# Altium project XilinxZynq7030SOM.PrjPcb (part 2 of 2)

## Sheet DDR3Modules.SchDoc
size A3; SheetNumber: 16; SheetTotal: 18
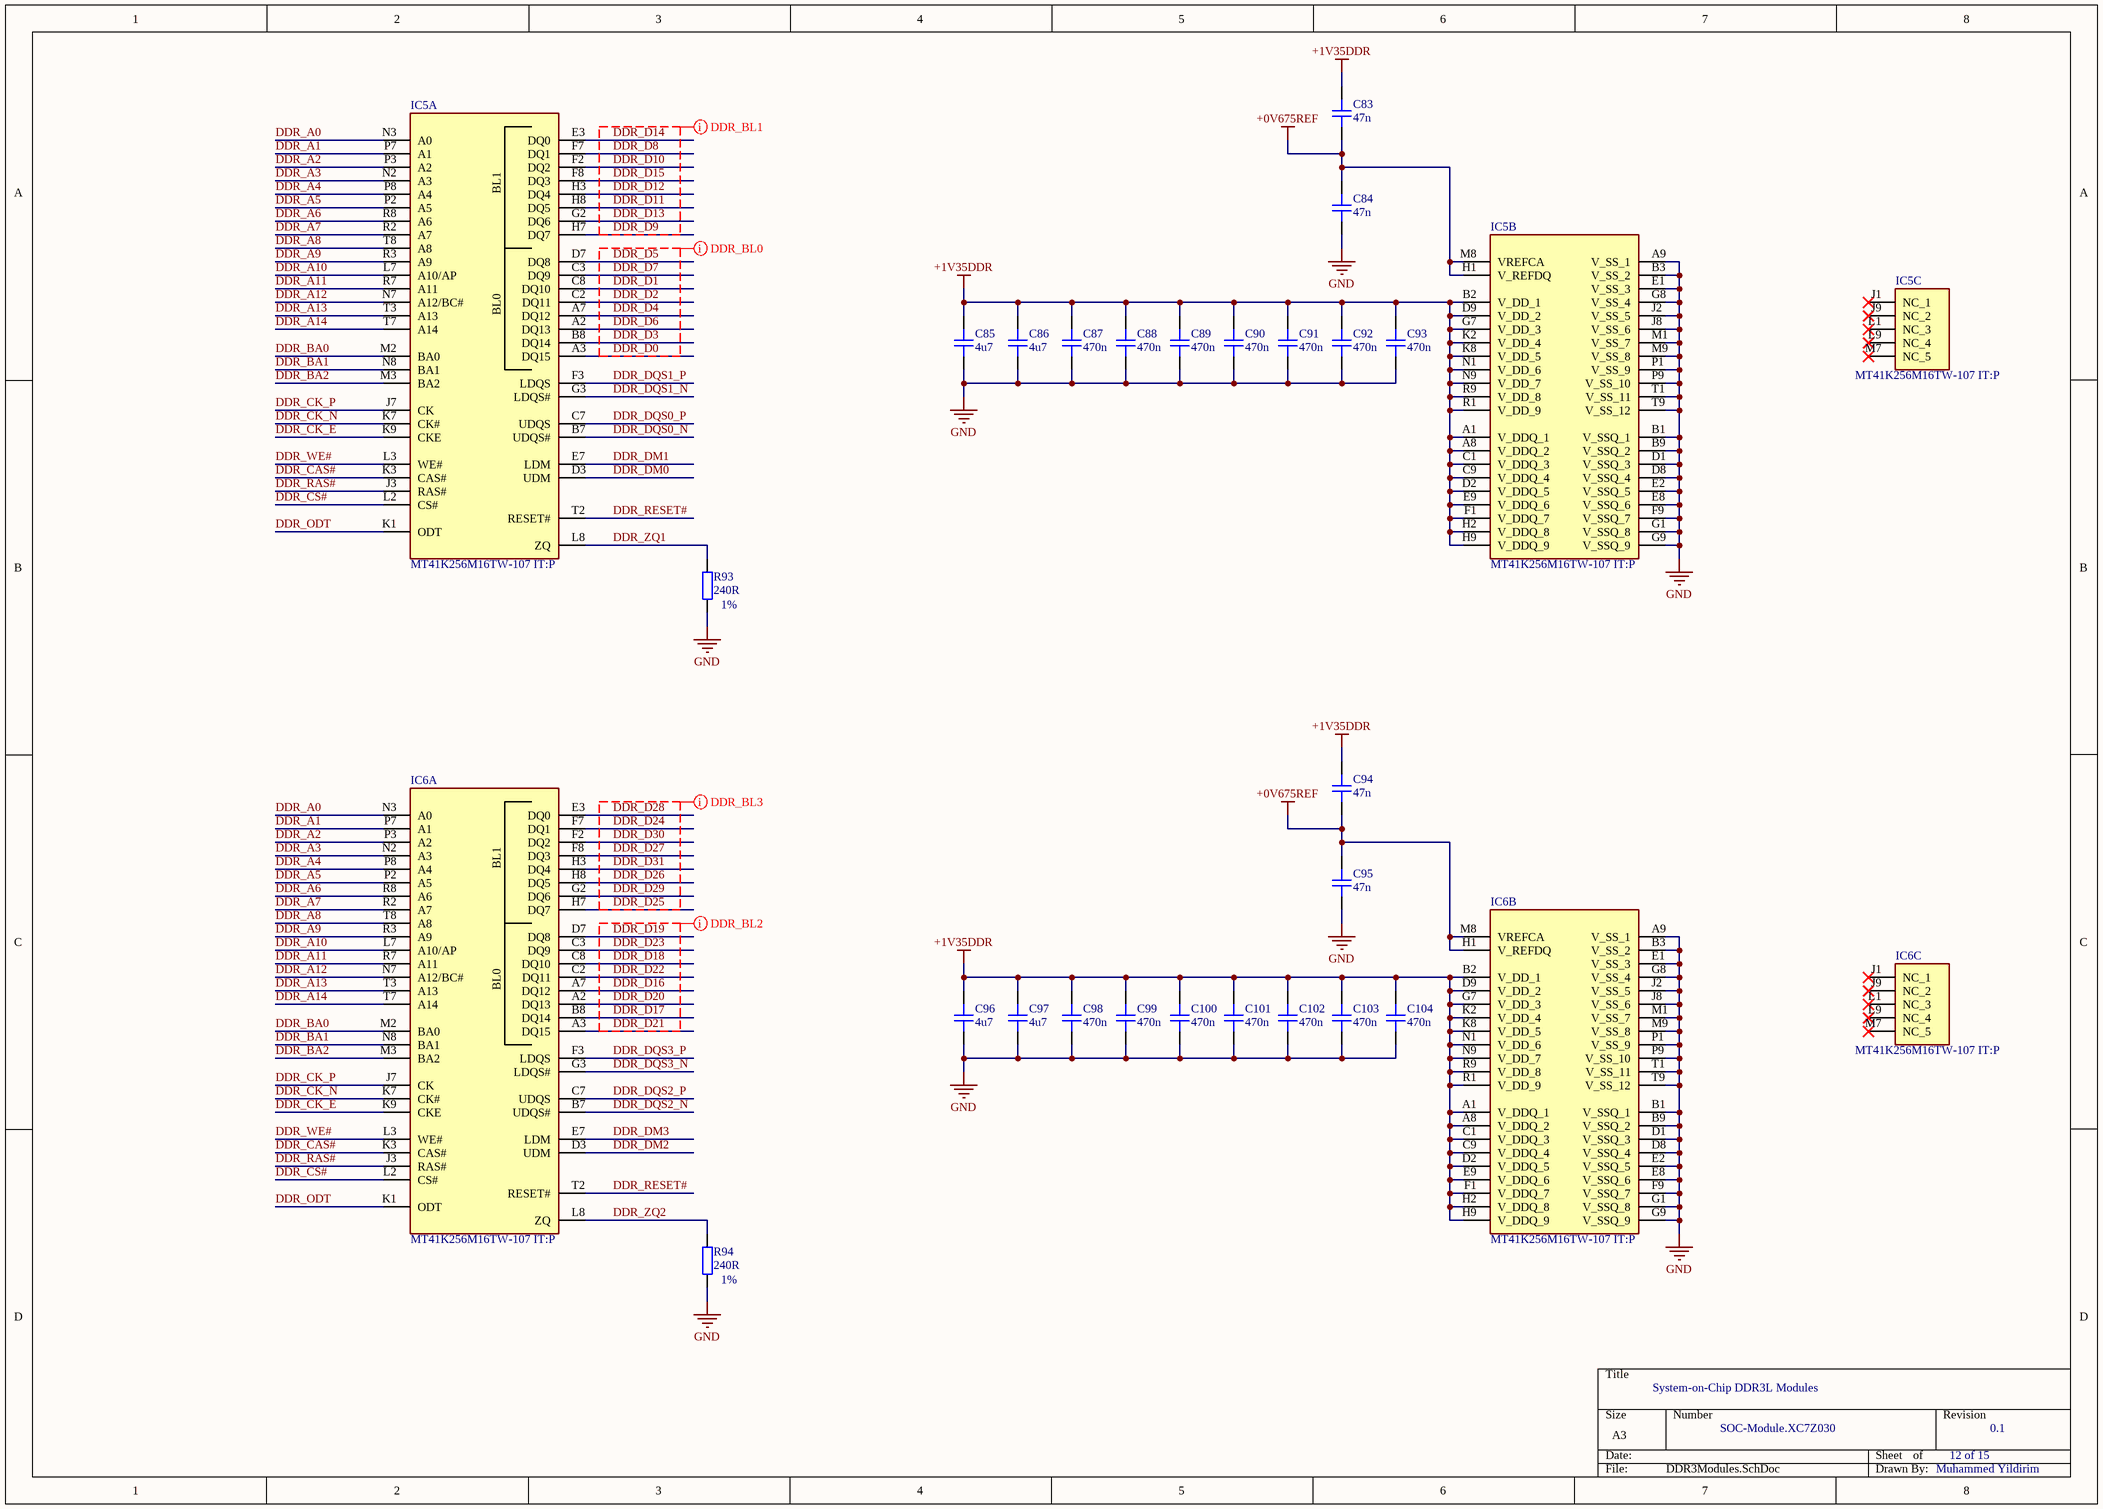
[diagram p15: DDR3Modules.SchDoc]

### Parts
C83  47n  [CAP_0201]
C84  47n  [CAP_0201]
C85  4u7  [CAP_0402]
C86  4u7  [CAP_0402]
C87  470n  [CAP_0201]
C88  470n  [CAP_0201]
C89  470n  [CAP_0201]
C90  470n  [CAP_0201]
C91  470n  [CAP_0201]
C92  470n  [CAP_0201]
C93  470n  [CAP_0201]
C94  47n  [CAP_0201]
C95  47n  [CAP_0201]
C96  4u7  [CAP_0402]
C97  4u7  [CAP_0402]
C98  470n  [CAP_0201]
C99  470n  [CAP_0201]
C100  470n  [CAP_0201]
C101  470n  [CAP_0201]
C102  470n  [CAP_0201]
C103  470n  [CAP_0201]
C104  470n  [CAP_0201]
IC5  MT41K256M16TW-107 IT:P  [BGA96C80P9X16_800X1400X120]  (parts A,B,C of 3)
IC6  MT41K256M16TW-107 IT:P  [BGA96C80P9X16_800X1400X120]  (parts A,B,C of 3)
R93  240R  [RES_0201]
R94  240R  [RES_0201]

### Nets
+0V675REF: C83.1 C84.2 C94.1 C95.2 IC5.H1(V_REFDQ) IC5.M8(VREFCA) IC6.H1(V_REFDQ) IC6.M8(VREFCA)
+1V35DDR: C83.2 C85.2 C86.2 C87.2 C88.2 C89.2 C90.2 C91.2 C92.2 C93.2 C94.2 C96.2 C97.2 C98.2 C99.2 C100.2 C101.2 C102.2 C103.2 C104.2 IC5.A1(V_DDQ_1) IC5.A8(V_DDQ_2) IC5.B2(V_DD_1) IC5.C1(V_DDQ_3) IC5.C9(V_DDQ_4) IC5.D2(V_DDQ_5) IC5.D9(V_DD_2) IC5.E9(V_DDQ_6) IC5.F1(V_DDQ_7) IC5.G7(V_DD_3) IC5.H2(V_DDQ_8) IC5.H9(V_DDQ_9) IC5.K2(V_DD_4) IC5.K8(V_DD_5) IC5.N1(V_DD_6) IC5.N9(V_DD_7) IC5.R1(V_DD_9) IC5.R9(V_DD_8) IC6.A1(V_DDQ_1) IC6.A8(V_DDQ_2) IC6.B2(V_DD_1) IC6.C1(V_DDQ_3) IC6.C9(V_DDQ_4) IC6.D2(V_DDQ_5) IC6.D9(V_DD_2) IC6.E9(V_DDQ_6) IC6.F1(V_DDQ_7) IC6.G7(V_DD_3) IC6.H2(V_DDQ_8) IC6.H9(V_DDQ_9) IC6.K2(V_DD_4) IC6.K8(V_DD_5) IC6.N1(V_DD_6) IC6.N9(V_DD_7) IC6.R1(V_DD_9) IC6.R9(V_DD_8)
GND: C84.1 C85.1 C86.1 C87.1 C88.1 C89.1 C90.1 C91.1 C92.1 C93.1 C95.1 C96.1 C97.1 C98.1 C99.1 C100.1 C101.1 C102.1 C103.1 C104.1 IC5.A9(V_SS_1) IC5.B1(V_SSQ_1) IC5.B3(V_SS_2) IC5.B9(V_SSQ_2) IC5.D1(V_SSQ_3) IC5.D8(V_SSQ_4) IC5.E1(V_SS_3) IC5.E2(V_SSQ_5) IC5.E8(V_SSQ_6) IC5.F9(V_SSQ_7) IC5.G1(V_SSQ_8) IC5.G8(V_SS_4) IC5.G9(V_SSQ_9) IC5.J2(V_SS_5) IC5.J8(V_SS_6) IC5.M1(V_SS_7) IC5.M9(V_SS_8) IC5.P1(V_SS_9) IC5.P9(V_SS_10) IC5.T1(V_SS_11) IC5.T9(V_SS_12) IC6.A9(V_SS_1) IC6.B1(V_SSQ_1) IC6.B3(V_SS_2) IC6.B9(V_SSQ_2) IC6.D1(V_SSQ_3) IC6.D8(V_SSQ_4) IC6.E1(V_SS_3) IC6.E2(V_SSQ_5) IC6.E8(V_SSQ_6) IC6.F9(V_SSQ_7) IC6.G1(V_SSQ_8) IC6.G8(V_SS_4) IC6.G9(V_SSQ_9) IC6.J2(V_SS_5) IC6.J8(V_SS_6) IC6.M1(V_SS_7) IC6.M9(V_SS_8) IC6.P1(V_SS_9) IC6.P9(V_SS_10) IC6.T1(V_SS_11) IC6.T9(V_SS_12) R93.1 R94.1
DDR_A0: IC5.N3(A0) IC6.N3(A0)
DDR_A1: IC5.P7(A1) IC6.P7(A1)
DDR_A2: IC5.P3(A2) IC6.P3(A2)
DDR_A3: IC5.N2(A3) IC6.N2(A3)
DDR_A4: IC5.P8(A4) IC6.P8(A4)
DDR_A5: IC5.P2(A5) IC6.P2(A5)
DDR_A6: IC5.R8(A6) IC6.R8(A6)
DDR_A7: IC5.R2(A7) IC6.R2(A7)
DDR_A8: IC5.T8(A8) IC6.T8(A8)
DDR_A9: IC5.R3(A9) IC6.R3(A9)
DDR_A10: IC5.L7(A10/AP) IC6.L7(A10/AP)
DDR_A11: IC5.R7(A11) IC6.R7(A11)
DDR_A12: IC5.N7(A12/BC#) IC6.N7(A12/BC#)
DDR_A13: IC5.T3(A13) IC6.T3(A13)
DDR_A14: IC5.T7(A14) IC6.T7(A14)
DDR_BA0: IC5.M2(BA0) IC6.M2(BA0)
DDR_BA1: IC5.N8(BA1) IC6.N8(BA1)
DDR_BA2: IC5.M3(BA2) IC6.M3(BA2)
DDR_CAS#: IC5.K3(CAS#) IC6.K3(CAS#)
DDR_CK_E: IC5.K9(CKE) IC6.K9(CKE)
DDR_CK_N: IC5.K7(CK#) IC6.K7(CK#)
DDR_CK_P: IC5.J7(CK) IC6.J7(CK)
DDR_CS#: IC5.L2(CS#) IC6.L2(CS#)
DDR_D0: IC5.A3(DQ15)
DDR_D1: IC5.C8(DQ10)
DDR_D2: IC5.C2(DQ11)
DDR_D3: IC5.B8(DQ14)
DDR_D4: IC5.A7(DQ12)
DDR_D5: IC5.D7(DQ8)
DDR_D6: IC5.A2(DQ13)
DDR_D7: IC5.C3(DQ9)
DDR_D8: IC5.F7(DQ1)
DDR_D9: IC5.H7(DQ7)
DDR_D10: IC5.F2(DQ2)
DDR_D11: IC5.H8(DQ5)
DDR_D12: IC5.H3(DQ4)
DDR_D13: IC5.G2(DQ6)
DDR_D14: IC5.E3(DQ0)
DDR_D15: IC5.F8(DQ3)
DDR_D16: IC6.A7(DQ12)
DDR_D17: IC6.B8(DQ14)
DDR_D18: IC6.C8(DQ10)
DDR_D19: IC6.D7(DQ8)
DDR_D20: IC6.A2(DQ13)
DDR_D21: IC6.A3(DQ15)
DDR_D22: IC6.C2(DQ11)
DDR_D23: IC6.C3(DQ9)
DDR_D24: IC6.F7(DQ1)
DDR_D25: IC6.H7(DQ7)
DDR_D26: IC6.H8(DQ5)
DDR_D27: IC6.F8(DQ3)
DDR_D28: IC6.E3(DQ0)
DDR_D29: IC6.G2(DQ6)
DDR_D30: IC6.F2(DQ2)
DDR_D31: IC6.H3(DQ4)
DDR_DM0: IC5.D3(UDM)
DDR_DM1: IC5.E7(LDM)
DDR_DM2: IC6.D3(UDM)
DDR_DM3: IC6.E7(LDM)
DDR_DQS0_N: IC5.B7(UDQS#)
DDR_DQS0_P: IC5.C7(UDQS)
DDR_DQS1_N: IC5.G3(LDQS#)
DDR_DQS1_P: IC5.F3(LDQS)
DDR_DQS2_N: IC6.B7(UDQS#)
DDR_DQS2_P: IC6.C7(UDQS)
DDR_DQS3_N: IC6.G3(LDQS#)
DDR_DQS3_P: IC6.F3(LDQS)
DDR_ODT: IC5.K1(ODT) IC6.K1(ODT)
DDR_RAS#: IC5.J3(RAS#) IC6.J3(RAS#)
DDR_RESET#: IC5.T2(RESET#) IC6.T2(RESET#)
DDR_WE#: IC5.L3(WE#) IC6.L3(WE#)
DDR_ZQ1: IC5.L8(ZQ) R93.2
DDR_ZQ2: IC6.L8(ZQ) R94.2

Not connected (* = marked no-connect by the designer): IC5 J1(NC_1)* J9(NC_2)* L1(NC_3)* L9(NC_4)* M7(NC_5)*; IC6 J1(NC_1)* J9(NC_2)* L1(NC_3)* L9(NC_4)* M7(NC_5)*

### Layout directives
mark named DDR_BL1: DDR_D8, DDR_D9, DDR_D10, DDR_D11, DDR_D12, DDR_D13, DDR_D14, DDR_D15
mark named DDR_BL0: DDR_D0, DDR_D1, DDR_D2, DDR_D3, DDR_D4, DDR_D5, DDR_D6, DDR_D7
mark named DDR_BL2: DDR_D16, DDR_D17, DDR_D18, DDR_D19, DDR_D20, DDR_D21, DDR_D22, DDR_D23
mark named DDR_BL3: DDR_D24, DDR_D25, DDR_D26, DDR_D27, DDR_D28, DDR_D29, DDR_D30, DDR_D31

### Notes on the sheet
- (near R93) 1%
- (near R94) 1%
- System-on-Chip DDR3L Modules
- SOC-Module.XC7Z030
- 12 of 15
- 0.1
- Muhammed Yildirim
- (in symbol MT41K256M16TW-107 IT:P, part A) BL1; BL0

### Library data of the parts
C83 C84 C87-C95 C98-C104 = CAP_0201: Capacitor SMD 0201; Manufacturer: *; Manufacturer Part Number: *; Distributor Link: *; LCSC: *; Rating: *; Dielectric: *
C85 C86 C96 C97 = CAP_0402: Capacitor SMD 0402; Manufacturer: *; Manufacturer Part Number: *; Distributor Link: *; LCSC: *; Rating: *; Dielectric: *
IC5 IC6 = MT41K256M16TW-107 IT:P: Integrated Circuit; Manufacturer_Name: Micron; Datasheet Link: https://datasheet.octopart.com/MT41K256M16TW-107-IT%3AP-Micron-datasheet-134530703.pdf; Height: 1.2mm; Manufacturer_Part_Number: MT41K256M16TW-107 IT:P; Mouser Part Number: 340-265862-TRAY; Mouser Price/Stock: https://www.mouser.co.uk/ProductDetail/Micron/MT41K256M16TW-107-ITP?qs=rrS6PyfT74dVaU4J%2FCiQdg%3D%3D; Arrow Part Number: MT41K256M16TW-107 IT:P; Arrow Price/Stock: https://www.arrow.com/en/products/mt41k256m16tw-107-itp/micron-technology?region=europe
R93 R94 = RES_0201: Resistor SMD 0201; Manufacturer: *; Manufacturer Part Number: *; Distributor Link: *; LCSC: *

## Sheet SOCEthernetPHY.SchDoc
size A4; SheetNumber: 17; SheetTotal: 18
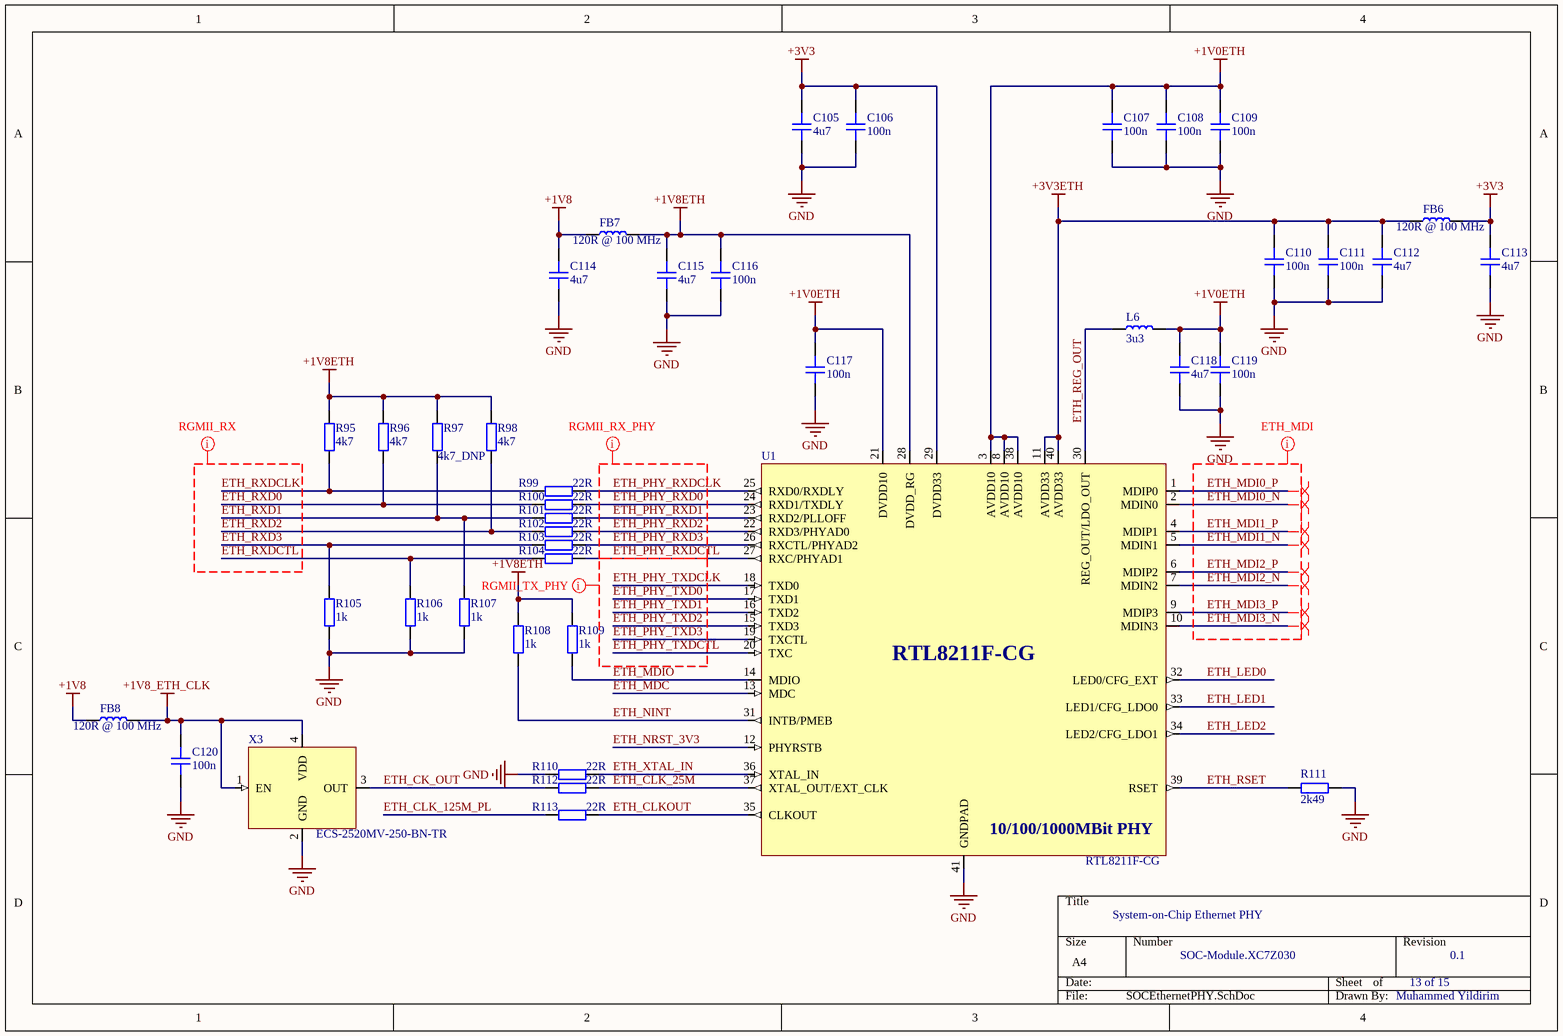
[diagram p16: SOCEthernetPHY.SchDoc]

### Parts
C105  4u7  [CAP_0402]
C106  100n  [CAP_0201]
C107  100n  [CAP_0201]
C108  100n  [CAP_0201]
C109  100n  [CAP_0201]
C110  100n  [CAP_0201]
C111  100n  [CAP_0201]
C112  4u7  [CAP_0402]
C113  4u7  [CAP_0402]
C114  4u7  [CAP_0402]
C115  4u7  [CAP_0402]
C116  100n  [CAP_0201]
C117  100n  [CAP_0201]
C118  4u7  [CAP_0402]
C119  100n  [CAP_0201]
C120  100n  [CAP_0201]
FB6  120R @ 100 MHz  [IND_0201]
FB7  120R @ 100 MHz  [IND_0201]
FB8  120R @ 100 MHz  [IND_0201]
L6  3u3  [IND_0402]
R95  4k7  [RES_0201]
R96  4k7  [RES_0201]
R97  4k7_DNP  [RES_0201]
R98  4k7  [RES_0201]
R99  22R  [RES_0201]
R100  22R  [RES_0201]
R101  22R  [RES_0201]
R102  22R  [RES_0201]
R103  22R  [RES_0201]
R104  22R  [RES_0201]
R105  1k  [RES_0201]
R106  1k  [RES_0201]
R107  1k  [RES_0201]
R108  1k  [RES_0201]
R109  1k  [RES_0201]
R110  22R  [RES_0201]
R111  2k49  [RES_0201]
R112  22R  [RES_0201]
R113  22R  [RES_0201]
U1  RTL8211F-CG  [QFN-40-0.4-EP]
X3  ECS-2520MV-250-BN-TR  [XTAL_2520]

### Nets
+1V0ETH: C107.2 C108.2 C109.2 C117.2 C118.2 C119.1 L6.2 U1.3(AVDD10) U1.8(AVDD10) U1.21(DVDD10) U1.38(AVDD10)
+1V8: C114.2 FB7.1 FB8.1
+1V8_ETH_CLK: C120.1 FB8.2 X3.1(EN) X3.4(VDD)
+1V8ETH: C115.2 C116.2 FB7.2 R95.1 R96.1 R97.1 R98.1 R108.1 R109.1 U1.28(DVDD_RG)
+3V3: C105.2 C106.2 C113.2 FB6.2 U1.29(DVDD33)
+3V3ETH: C110.1 C111.1 C112.2 FB6.1 U1.11(AVDD33) U1.40(AVDD33)
GND: C105.1 C106.1 C107.1 C108.1 C109.1 C110.2 C111.2 C112.1 C113.1 C114.1 C115.1 C116.1 C117.1 C118.1 C119.2 C120.2 R105.2 R106.2 R107.2 R110.1 R111.1 U1.41(GNDPAD) X3.2(GND)
ETH_CK_OUT: R112.1 X3.3(OUT)
ETH_CLK_25M: R112.2 U1.37(XTAL_OUT/EXT_CLK)
ETH_CLK_125M_PL: R113.1
ETH_CLKOUT: R113.2 U1.35(CLKOUT)
ETH_LED0: U1.32(LED0/CFG_EXT)
ETH_LED1: U1.33(LED1/CFG_LDO0)
ETH_LED2: U1.34(LED2/CFG_LDO1)
ETH_MDC: U1.13(MDC)
ETH_MDI0_N: U1.2(MDIN0)
ETH_MDI0_P: U1.1(MDIP0)
ETH_MDI1_N: U1.5(MDIN1)
ETH_MDI1_P: U1.4(MDIP1)
ETH_MDI2_N: U1.7(MDIN2)
ETH_MDI2_P: U1.6(MDIP2)
ETH_MDI3_N: U1.10(MDIN3)
ETH_MDI3_P: U1.9(MDIP3)
ETH_MDIO: R109.2 U1.14(MDIO)
ETH_NINT: R108.2 U1.31(INTB/PMEB)
ETH_NRST_3V3: U1.12(PHYRSTB)
ETH_PHY_RXD0: R100.1 U1.24(RXD1/TXDLY)
ETH_PHY_RXD1: R101.1 U1.23(RXD2/PLLOFF)
ETH_PHY_RXD2: R102.1 U1.22(RXD3/PHYAD0)
ETH_PHY_RXD3: R103.1 U1.26(RXCTL/PHYAD2)
ETH_PHY_RXDCLK: R99.1 U1.25(RXD0/RXDLY)
ETH_PHY_RXDCTL: R104.1 U1.27(RXC/PHYAD1)
ETH_PHY_TXD0: U1.17(TXD1)
ETH_PHY_TXD1: U1.16(TXD2)
ETH_PHY_TXD2: U1.15(TXD3)
ETH_PHY_TXD3: U1.19(TXCTL)
ETH_PHY_TXDCLK: U1.18(TXD0)
ETH_PHY_TXDCTL: U1.20(TXC)
ETH_REG_OUT: L6.1 U1.30(REG_OUT/LDO_OUT)
ETH_RSET: R111.2 U1.39(RSET)
ETH_RXD0: R96.2 R100.2
ETH_RXD1: R97.2 R101.2 R107.1
ETH_RXD2: R98.2 R102.2
ETH_RXD3: R103.2 R105.1
ETH_RXDCLK: R95.2 R99.2
ETH_RXDCTL: R104.2 R106.1
ETH_XTAL_IN: R110.2 U1.36(XTAL_IN)

### Layout directives
differential pair: ETH_MDI0_N, ETH_MDI0_P, ETH_MDI1_N, ETH_MDI1_P, ETH_MDI2_N, ETH_MDI2_P, ETH_MDI3_N, ETH_MDI3_P
mark named ETH_MDI: ETH_MDI0_N, ETH_MDI0_P, ETH_MDI1_N, ETH_MDI1_P, ETH_MDI2_N, ETH_MDI2_P, ETH_MDI3_N, ETH_MDI3_P
mark named RGMII_RX_PHY: ETH_PHY_RXD0, ETH_PHY_RXD1, ETH_PHY_RXD2, ETH_PHY_RXD3, ETH_PHY_RXDCLK, ETH_PHY_RXDCTL
mark named RGMII_RX: ETH_RXD0, ETH_RXD1, ETH_RXD2, ETH_RXD3, ETH_RXDCLK, ETH_RXDCTL
mark named RGMII_TX_PHY: ETH_PHY_RXDCTL, ETH_PHY_TXD0, ETH_PHY_TXD1, ETH_PHY_TXD2, ETH_PHY_TXD3, ETH_PHY_TXDCLK, ETH_PHY_TXDCTL

### Notes on the sheet
- System-on-Chip Ethernet PHY
- SOC-Module.XC7Z030
- 13 of 15
- 0.1
- Muhammed Yildirim
- (in symbol RTL8211F-CG) 10/100/1000MBit PHY

### Library data of the parts
C105 C112-C115 C118 = CAP_0402: Capacitor SMD 0402; Manufacturer: *; Manufacturer Part Number: *; Distributor Link: *; LCSC: *; Rating: *; Dielectric: *
C106-C111 C116 C117 C119 C120 = CAP_0201: Capacitor SMD 0201; Manufacturer: *; Manufacturer Part Number: *; Distributor Link: *; LCSC: *; Rating: *; Dielectric: *
FB6-FB8 = IND_0201: Inductor SMD 0201; Manufacturer_Name: Murata Electronics; Manufacturer_Part_Number: LQP03HQ56NH02D; Datasheet Link: https://psearch.en.murata.com/inductor/product/LQP03HQ56NH02%23.html; Height: 0.42mm; Mouser Part Number: 81-LQP03HQ56NH02D; Mouser Price/Stock: https://www.mouser.co.uk/ProductDetail/Murata-Electronics/LQP03HQ56NH02D?qs=B6kkDfuK7%2FBQu1Ob9%2FT2Bg%3D%3D
L6 = IND_0402: Inductor SMD 0402
R95-R113 = RES_0201: Resistor SMD 0201; Manufacturer: *; Manufacturer Part Number: *; Distributor Link: *; LCSC: *
U1 = RTL8211F-CG: INTEGRATED 10/100/1000M ETHERNET PRECISION TRANSCEIVER; Manufacturer: Realtek; Manufacturer Part Number: RTL8211F-CG
X3 = ECS-2520MV-130-BN-TR: Standard Clock Oscillators XO (Standard),13MHz,Standby (Power Down),CMOS, Multi-Volt,1.6 V 3.6 V,+/-50ppm,-40 C 85 C,6mA,Surface Mount,4-SMD, No Lead,(2.50mm x 2.00mm),(0.80mm); Manufacturer: ECS; Manufacturer Part Number: ECS-2520MV-130-BN-TR

## Sheet SOCUSBHSPHY.SchDoc
size A4; SheetNumber: 18; SheetTotal: 18
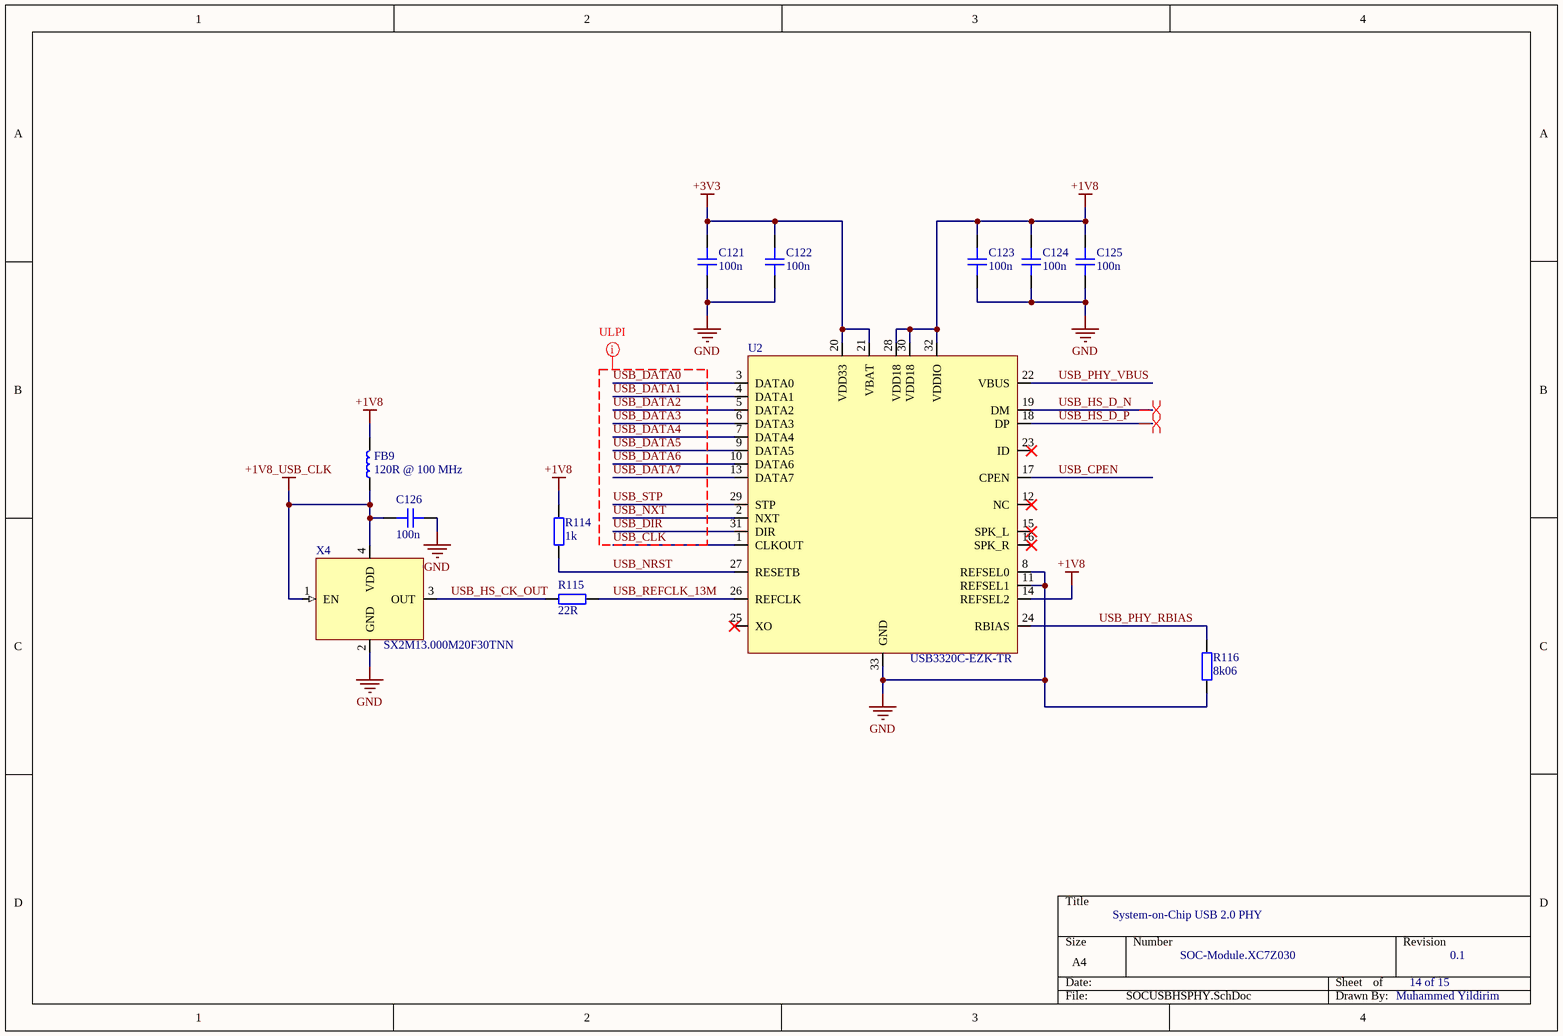
[diagram p17: SOCUSBHSPHY.SchDoc]

### Parts
C121  100n  [CAP_0201]
C122  100n  [CAP_0201]
C123  100n  [CAP_0201]
C124  100n  [CAP_0201]
C125  100n  [CAP_0201]
C126  100n  [CAP_0201]
FB9  120R @ 100 MHz  [IND_0201]
R114  1k  [RES_0201]
R115  22R  [RES_0201]
R116  8k06  [RES_0201]
U2  USB3320C-EZK-TR  [QFN-32-5x5x0.85mm]
X4  SX2M13.000M20F30TNN  [XTAL_2520]

### Nets
+1V8: C123.2 C124.2 C125.2 FB9.2 R114.1 U2.14(REFSEL2) U2.28(VDD18) U2.30(VDD18) U2.32(VDDIO)
+1V8_USB_CLK: C126.2 FB9.1 X4.1(EN) X4.4(VDD)
+3V3: C121.2 C122.2 U2.20(VDD33) U2.21(VBAT)
GND: C121.1 C122.1 C123.1 C124.1 C125.1 C126.1 R116.1 U2.8(REFSEL0) U2.11(REFSEL1) U2.33(GND) X4.2(GND)
USB_CLK: U2.1(CLKOUT)
USB_CPEN: U2.17(CPEN)
USB_DATA0: U2.3(DATA0)
USB_DATA1: U2.4(DATA1)
USB_DATA2: U2.5(DATA2)
USB_DATA3: U2.6(DATA3)
USB_DATA4: U2.7(DATA4)
USB_DATA5: U2.9(DATA5)
USB_DATA6: U2.10(DATA6)
USB_DATA7: U2.13(DATA7)
USB_DIR: U2.31(DIR)
USB_HS_CK_OUT: R115.1 X4.3(OUT)
USB_HS_D_N: U2.19(DM)
USB_HS_D_P: U2.18(DP)
USB_NRST: R114.2 U2.27(RESETB)
USB_NXT: U2.2(NXT)
USB_PHY_RBIAS: R116.2 U2.24(RBIAS)
USB_PHY_VBUS: U2.22(VBUS)
USB_REFCLK_13M: R115.2 U2.26(REFCLK)
USB_STP: U2.29(STP)

Not connected (* = marked no-connect by the designer): U2 12(NC)* 15(SPK_L)* 16(SPK_R)* 23(ID)* 25(XO)*

### Layout directives
mark named ULPI: USB_CLK, USB_DATA0, USB_DATA1, USB_DATA2, USB_DATA3, USB_DATA4, USB_DATA5, USB_DATA6, USB_DATA7, USB_DIR, USB_NXT, USB_STP
differential pair: USB_HS_D_N, USB_HS_D_P

### Notes on the sheet
- System-on-Chip USB 2.0 PHY
- SOC-Module.XC7Z030
- 14 of 15
- 0.1
- Muhammed Yildirim

### Library data of the parts
C121-C126 = CAP_0201: Capacitor SMD 0201; Manufacturer: *; Manufacturer Part Number: *; Distributor Link: *; LCSC: *; Rating: *; Dielectric: *
FB9 = IND_0201: as FB6 on sheet SOCEthernetPHY; Datasheet Link: https://psearch.en.murata.com/inductor/product/LQP03HQ56NH02%23.html; Height: 0.42mm; Mouser Part Number: 81-LQP03HQ56NH02D; Mouser Price/Stock: https://www.mouser.co.uk/ProductDetail/Murata-Electronics/LQP03HQ56NH02D?qs=B6kkDfuK7%2FBQu1Ob9%2FT2Bg%3D%3D
R114-R116 = RES_0201: Resistor SMD 0201; Manufacturer: *; Manufacturer Part Number: *; Distributor Link: *; LCSC: *
U2 = USB3320C-EZK-TR: Hi-Speed USB 2.0 ULPI Transceiver; Manufacturer: Microchip; Manufacturer Part Number: USB3320C-EZK-TR
X4 = ECS-2520MV-130-BN-TR: as X3 on sheet SOCEthernetPHY; Manufacturer Part Number: ECS-2520MV-130-BN-TR

## Sheet MezzanineConnections.SchDoc
size A3; SheetNumber: 19; SheetTotal: 18
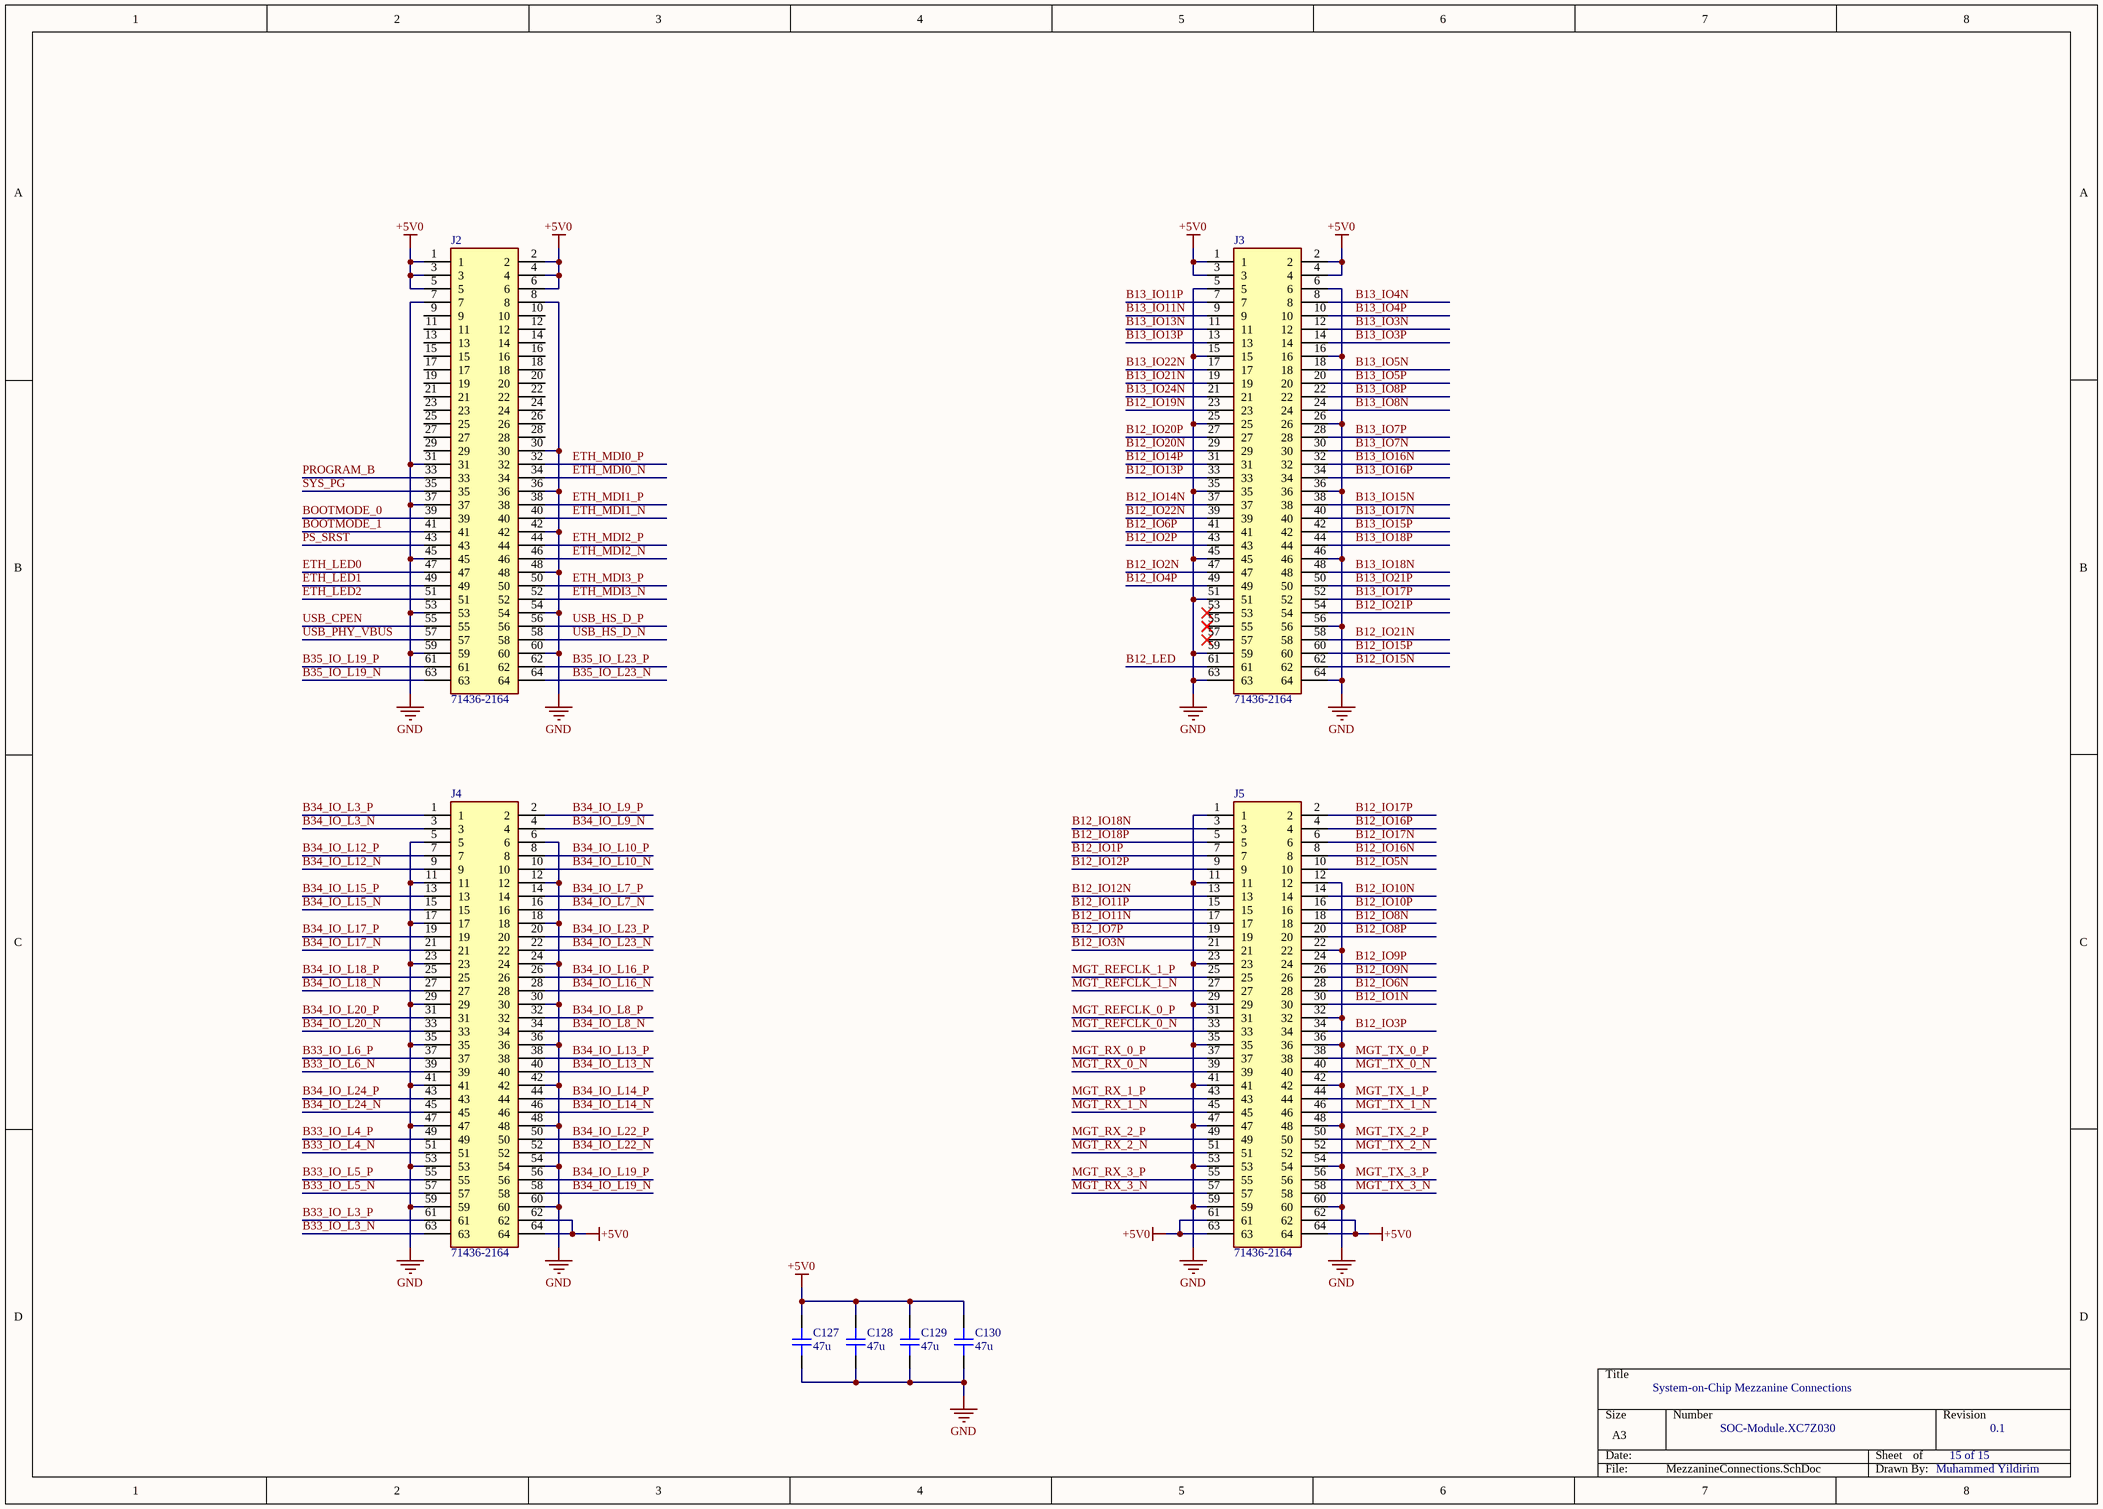
[diagram p18: MezzanineConnections.SchDoc]

### Parts
C127  47u  [CAP_0805]
C128  47u  [CAP_0805]
C129  47u  [CAP_0805]
C130  47u  [CAP_0805]
J2  71436-2164  [714362164]
J3  71436-2164  [714362164]
J4  71436-2164  [714362164]
J5  71436-2164  [714362164]

### Nets
+5V0: C127.2 C128.2 C129.2 C130.2 J2.1 J2.2 J2.3 J2.4 J2.5 J2.6 J3.1 J3.2 J3.3 J3.4 J4.62 J4.64 J5.61 J5.62 J5.63 J5.64
GND: C127.1 C128.1 C129.1 C130.1 J2.7 J2.8 J2.30 J2.31 J2.36 J2.37 J2.42 J2.45 J2.48 J2.53 J2.54 J2.59 J2.60 J3.5 J3.6 J3.15 J3.16 J3.25 J3.26 J3.35 J3.36 J3.45 J3.46 J3.51 J3.56 J3.59 J3.63 J3.64 J4.5 J4.6 J4.11 J4.12 J4.17 J4.18 J4.23 J4.24 J4.29 J4.30 J4.35 J4.36 J4.41 J4.42 J4.47 J4.48 J4.53 J4.54 J4.59 J4.60 J5.1 J5.11 J5.12 J5.22 J5.23 J5.29 J5.32 J5.35 J5.36 J5.41 J5.42 J5.47 J5.48 J5.53 J5.54 J5.59 J5.60
B12_IO1N: J5.30
B12_IO1P: J5.7
B12_IO2N: J3.47
B12_IO2P: J3.43
B12_IO3N: J5.21
B12_IO3P: J5.34
B12_IO4P: J3.49
B12_IO5N: J5.10
B12_IO6N: J5.28
B12_IO6P: J3.41
B12_IO7P: J5.19
B12_IO8N: J5.18
B12_IO8P: J5.20
B12_IO9N: J5.26
B12_IO9P: J5.24
B12_IO10N: J5.14
B12_IO10P: J5.16
B12_IO11N: J5.17
B12_IO11P: J5.15
B12_IO12N: J5.13
B12_IO12P: J5.9
B12_IO13P: J3.33
B12_IO14N: J3.37
B12_IO14P: J3.31
B12_IO15N: J3.62
B12_IO15P: J3.60
B12_IO16N: J5.8
B12_IO16P: J5.4
B12_IO17N: J5.6
B12_IO17P: J5.2
B12_IO18N: J5.3
B12_IO18P: J5.5
B12_IO19N: J3.23
B12_IO20N: J3.29
B12_IO20P: J3.27
B12_IO21N: J3.58
B12_IO21P: J3.54
B12_IO22N: J3.39
B12_LED: J3.61
B13_IO3N: J3.12
B13_IO3P: J3.14
B13_IO4N: J3.8
B13_IO4P: J3.10
B13_IO5N: J3.18
B13_IO5P: J3.20
B13_IO7N: J3.30
B13_IO7P: J3.28
B13_IO8N: J3.24
B13_IO8P: J3.22
B13_IO11N: J3.9
B13_IO11P: J3.7
B13_IO13N: J3.11
B13_IO13P: J3.13
B13_IO15N: J3.38
B13_IO15P: J3.42
B13_IO16N: J3.32
B13_IO16P: J3.34
B13_IO17N: J3.40
B13_IO17P: J3.52
B13_IO18N: J3.48
B13_IO18P: J3.44
B13_IO21N: J3.19
B13_IO21P: J3.50
B13_IO22N: J3.17
B13_IO24N: J3.21
B33_IO_L3_N: J4.63
B33_IO_L3_P: J4.61
B33_IO_L4_N: J4.51
B33_IO_L4_P: J4.49
B33_IO_L5_N: J4.57
B33_IO_L5_P: J4.55
B33_IO_L6_N: J4.39
B33_IO_L6_P: J4.37
B34_IO_L3_N: J4.3
B34_IO_L3_P: J4.1
B34_IO_L7_N: J4.16
B34_IO_L7_P: J4.14
B34_IO_L8_N: J4.34
B34_IO_L8_P: J4.32
B34_IO_L9_N: J4.4
B34_IO_L9_P: J4.2
B34_IO_L10_N: J4.10
B34_IO_L10_P: J4.8
B34_IO_L12_N: J4.9
B34_IO_L12_P: J4.7
B34_IO_L13_N: J4.40
B34_IO_L13_P: J4.38
B34_IO_L14_N: J4.46
B34_IO_L14_P: J4.44
B34_IO_L15_N: J4.15
B34_IO_L15_P: J4.13
B34_IO_L16_N: J4.28
B34_IO_L16_P: J4.26
B34_IO_L17_N: J4.21
B34_IO_L17_P: J4.19
B34_IO_L18_N: J4.27
B34_IO_L18_P: J4.25
B34_IO_L19_N: J4.58
B34_IO_L19_P: J4.56
B34_IO_L20_N: J4.33
B34_IO_L20_P: J4.31
B34_IO_L22_N: J4.52
B34_IO_L22_P: J4.50
B34_IO_L23_N: J4.22
B34_IO_L23_P: J4.20
B34_IO_L24_N: J4.45
B34_IO_L24_P: J4.43
B35_IO_L19_N: J2.63
B35_IO_L19_P: J2.61
B35_IO_L23_N: J2.64
B35_IO_L23_P: J2.62
BOOTMODE_0: J2.39
BOOTMODE_1: J2.41
ETH_LED0: J2.47
ETH_LED1: J2.49
ETH_LED2: J2.51
ETH_MDI0_N: J2.34
ETH_MDI0_P: J2.32
ETH_MDI1_N: J2.40
ETH_MDI1_P: J2.38
ETH_MDI2_N: J2.46
ETH_MDI2_P: J2.44
ETH_MDI3_N: J2.52
ETH_MDI3_P: J2.50
MGT_REFCLK_0_N: J5.33
MGT_REFCLK_0_P: J5.31
MGT_REFCLK_1_N: J5.27
MGT_REFCLK_1_P: J5.25
MGT_RX_0_N: J5.39
MGT_RX_0_P: J5.37
MGT_RX_1_N: J5.45
MGT_RX_1_P: J5.43
MGT_RX_2_N: J5.51
MGT_RX_2_P: J5.49
MGT_RX_3_N: J5.57
MGT_RX_3_P: J5.55
MGT_TX_0_N: J5.40
MGT_TX_0_P: J5.38
MGT_TX_1_N: J5.46
MGT_TX_1_P: J5.44
MGT_TX_2_N: J5.52
MGT_TX_2_P: J5.50
MGT_TX_3_N: J5.58
MGT_TX_3_P: J5.56
PROGRAM_B: J2.33
PS_SRST: J2.43
SYS_PG: J2.35
USB_CPEN: J2.55
USB_HS_D_N: J2.58
USB_HS_D_P: J2.56
USB_PHY_VBUS: J2.57

Not connected (* = marked no-connect by the designer): J2 9 10 11 12 13 14 15 16 17 18 19 20 21 22 23 24 25 26 27 28 29; J3 53* 55* 57*

### Notes on the sheet
- System-on-Chip Mezzanine Connections
- SOC-Module.XC7Z030
- 15 of 15
- 0.1
- Muhammed Yildirim

### Library data of the parts
C127-C130 = CAP_0805: Capacitor SMD 0805; Manufacturer: *; Manufacturer Part Number: *; Distributor Link: *; LCSC: *; Rating: *; Dielectric: *
J2-J5 = 71436-2164: Molex MEZZANINE Series, Series Number 71436, 1mm Pitch 64 Way 2 Row Straight PCB Header, Solder Termination, 1A; Geometry.Height: 8.48mm; Mouser Part Number: 538-71436-2164; Mouser Price/Stock: https://www.mouser.co.uk/ProductDetail/Molex/71436-2164?qs=X1mjqRbeMc536fw4qEA%252B%252Bg%3D%3D; Manufacturer_Name: Molex; Manufacturer_Part_Number: 71436-2164; Datasheet Link: *

## Nets that join several sheets
+0V675: SOCPowerSupplys (5 pins), SOCDDR3Bank (36 pins)
+0V675REF: SOCPowerSupplys (C26.2 IC1.6), SOCDDR3Bank (C69.2 C70.2 IC2.K21 IC2.M21), DDR3Modules (8 pins)
+1V0: SOCPowerSupplys (B1.16 C3.2 L1.2 R1.2), SOCPowerDecoupling (32 pins)
+1V2: SOCPowerSupplys (B3.16 C11.2 L3.2 R9.2), SOCPowerDecoupling (11 pins), PLMGTBanks (IC2.AB7 R38.2)
+1V8: SOCPowerSupplys (B2.16 C4.2 L2.2 R2.2), SOCPowerDecoupling (53 pins), PLBank33 (FB4.1), SOCPSBanks (FB5.1 R39.1 R42.2), SOCEthernetPHY (C114.2 FB7.1 FB8.1), SOCUSBHSPHY (9 pins)
+1V35DDR: SOCPowerSupplys (8 pins), SOCPowerDecoupling (10 pins), SOCDDR3Bank (R91.2), DDR3Modules (56 pins)
+3V3: SOCPowerSupplys (9 pins), SOCPowerDecoupling (23 pins), SOCConfiguration (12 pins), SOCPSBanks (9 pins), SOCEthernetPHY (5 pins), SOCUSBHSPHY (C121.2 C122.2 U2.20 U2.21)
+5V0: SOCPowerSupplys (30 pins), MezzanineConnections (20 pins)
GND: SOCPowerSupplys (58 pins), SOCPowerDecoupling (155 pins), SOCConfiguration (17 pins), PLBank33 (C63.2 X1.2), SOCPSBanks (16 pins), SOCDDR3Bank (16 pins), DDR3Modules (64 pins), SOCEthernetPHY (23 pins), SOCUSBHSPHY (11 pins), MezzanineConnections (69 pins)
B12_IO1N: PLBank12 (IC2.Y11), MezzanineConnections (J5.30)
B12_IO1P: PLBank12 (IC2.Y12), MezzanineConnections (J5.7)
B12_IO2N: PLBank12 (IC2.AC11), MezzanineConnections (J3.47)
B12_IO2P: PLBank12 (IC2.AB12), MezzanineConnections (J3.43)
B12_IO3N: PLBank12 (IC2.AA10), MezzanineConnections (J5.21)
B12_IO3P: PLBank12 (IC2.Y10), MezzanineConnections (J5.34)
B12_IO4P: PLBank12 (IC2.AB11), MezzanineConnections (J3.49)
B12_IO5N: PLBank12 (IC2.Y13), MezzanineConnections (J5.10)
B12_IO6N: PLBank12 (IC2.AA12), MezzanineConnections (J5.28)
B12_IO6P: PLBank12 (IC2.AA13), MezzanineConnections (J3.41)
B12_IO7P: PLBank12 (IC2.AE10), MezzanineConnections (J5.19)
B12_IO8N: PLBank12 (IC2.AF12), MezzanineConnections (J5.18)
B12_IO8P: PLBank12 (IC2.AE12), MezzanineConnections (J5.20)
B12_IO9N: PLBank12 (IC2.AF10), MezzanineConnections (J5.26)
B12_IO9P: PLBank12 (IC2.AE11), MezzanineConnections (J5.24)
B12_IO10N: PLBank12 (IC2.AF13), MezzanineConnections (J5.14)
B12_IO10P: PLBank12 (IC2.AE13), MezzanineConnections (J5.16)
B12_IO11N: PLBank12 (IC2.AD11), MezzanineConnections (J5.17)
B12_IO11P: PLBank12 (IC2.AC12), MezzanineConnections (J5.15)
B12_IO12N: PLBank12 (IC2.AD13), MezzanineConnections (J5.13)
B12_IO12P: PLBank12 (IC2.AC13), MezzanineConnections (J5.9)
B12_IO13P: PLBank12 (IC2.AC14), MezzanineConnections (J3.33)
B12_IO14N: PLBank12 (IC2.AB14), MezzanineConnections (J3.37)
B12_IO14P: PLBank12 (IC2.AB15), MezzanineConnections (J3.31)
B12_IO15N: PLBank12 (IC2.AD15), MezzanineConnections (J3.62)
B12_IO15P: PLBank12 (IC2.AD16), MezzanineConnections (J3.60)
B12_IO16N: PLBank12 (IC2.AF14), MezzanineConnections (J5.8)
B12_IO16P: PLBank12 (IC2.AF15), MezzanineConnections (J5.4)
B12_IO17N: PLBank12 (IC2.AE15), MezzanineConnections (J5.6)
B12_IO17P: PLBank12 (IC2.AE16), MezzanineConnections (J5.2)
B12_IO18N: PLBank12 (IC2.AF17), MezzanineConnections (J5.3)
B12_IO18P: PLBank12 (IC2.AE17), MezzanineConnections (J5.5)
B12_IO19N: PLBank12 (IC2.AA17), MezzanineConnections (J3.23)
B12_IO20N: PLBank12 (IC2.AB16), MezzanineConnections (J3.29)
B12_IO20P: PLBank12 (IC2.AB17), MezzanineConnections (J3.27)
B12_IO21N: PLBank12 (IC2.AC16), MezzanineConnections (J3.58)
B12_IO21P: PLBank12 (IC2.AC17), MezzanineConnections (J3.54)
B12_IO22N: PLBank12 (IC2.AA14), MezzanineConnections (J3.39)
B12_LED: PLBank12 (IC2.W17), MezzanineConnections (J3.61)
B13_IO3N: PLBank13 (IC2.AE26), MezzanineConnections (J3.12)
B13_IO3P: PLBank13 (IC2.AE25), MezzanineConnections (J3.14)
B13_IO4N: PLBank13 (IC2.AD26), MezzanineConnections (J3.8)
B13_IO4P: PLBank13 (IC2.AD25), MezzanineConnections (J3.10)
B13_IO5N: PLBank13 (IC2.AF25), MezzanineConnections (J3.18)
B13_IO5P: PLBank13 (IC2.AF24), MezzanineConnections (J3.20)
B13_IO7N: PLBank13 (IC2.AF22), MezzanineConnections (J3.30)
B13_IO7P: PLBank13 (IC2.AE22), MezzanineConnections (J3.28)
B13_IO8N: PLBank13 (IC2.AF23), MezzanineConnections (J3.24)
B13_IO8P: PLBank13 (IC2.AE23), MezzanineConnections (J3.22)
B13_IO11N: PLBank13 (IC2.AD24), MezzanineConnections (J3.9)
B13_IO11P: PLBank13 (IC2.AD23), MezzanineConnections (J3.7)
B13_IO13N: PLBank13 (IC2.AD21), MezzanineConnections (J3.11)
B13_IO13P: PLBank13 (IC2.AD20), MezzanineConnections (J3.13)
B13_IO15N: PLBank13 (IC2.AF20), MezzanineConnections (J3.38)
B13_IO15P: PLBank13 (IC2.AF19), MezzanineConnections (J3.42)
B13_IO16N: PLBank13 (IC2.AE21), MezzanineConnections (J3.32)
B13_IO16P: PLBank13 (IC2.AE20), MezzanineConnections (J3.34)
B13_IO17N: PLBank13 (IC2.AD19), MezzanineConnections (J3.40)
B13_IO17P: PLBank13 (IC2.AD18), MezzanineConnections (J3.52)
B13_IO18N: PLBank13 (IC2.AF18), MezzanineConnections (J3.48)
B13_IO18P: PLBank13 (IC2.AE18), MezzanineConnections (J3.44)
B13_IO21N: PLBank13 (IC2.AC19), MezzanineConnections (J3.19)
B13_IO21P: PLBank13 (IC2.AC18), MezzanineConnections (J3.50)
B13_IO22N: PLBank13 (IC2.AB19), MezzanineConnections (J3.17)
B13_IO24N: PLBank13 (IC2.AA18), MezzanineConnections (J3.21)
B33_IO_L3_N: PLBank33 (IC2.F2), MezzanineConnections (J4.63)
B33_IO_L3_P: PLBank33 (IC2.G2), MezzanineConnections (J4.61)
B33_IO_L4_N: PLBank33 (IC2.C1), MezzanineConnections (J4.51)
B33_IO_L4_P: PLBank33 (IC2.D1), MezzanineConnections (J4.49)
B33_IO_L5_N: PLBank33 (IC2.E1), MezzanineConnections (J4.57)
B33_IO_L5_P: PLBank33 (IC2.E2), MezzanineConnections (J4.55)
B33_IO_L6_N: PLBank33 (IC2.E3), MezzanineConnections (J4.39)
B33_IO_L6_P: PLBank33 (IC2.F3), MezzanineConnections (J4.37)
B34_IO_L3_N: PLBank34 (IC2.G9), MezzanineConnections (J4.3)
B34_IO_L3_P: PLBank34 (IC2.H9), MezzanineConnections (J4.1)
B34_IO_L7_N: PLBank34 (IC2.E5), MezzanineConnections (J4.16)
B34_IO_L7_P: PLBank34 (IC2.F5), MezzanineConnections (J4.14)
B34_IO_L8_N: PLBank34 (IC2.D8), MezzanineConnections (J4.34)
B34_IO_L8_P: PLBank34 (IC2.D9), MezzanineConnections (J4.32)
B34_IO_L9_N: PLBank34 (IC2.E8), MezzanineConnections (J4.4)
B34_IO_L9_P: PLBank34 (IC2.F9), MezzanineConnections (J4.2)
B34_IO_L10_N: PLBank34 (IC2.D5), MezzanineConnections (J4.10)
B34_IO_L10_P: PLBank34 (IC2.E6), MezzanineConnections (J4.8)
B34_IO_L12_N: PLBank34 (IC2.F7), MezzanineConnections (J4.9)
B34_IO_L12_P: PLBank34 (IC2.G7), MezzanineConnections (J4.7)
B34_IO_L13_N: PLBank34 (IC2.C7), MezzanineConnections (J4.40)
B34_IO_L13_P: PLBank34 (IC2.C8), MezzanineConnections (J4.38)
B34_IO_L14_N: PLBank34 (IC2.C6), MezzanineConnections (J4.46)
B34_IO_L14_P: PLBank34 (IC2.D6), MezzanineConnections (J4.44)
B34_IO_L15_N: PLBank34 (IC2.B9), MezzanineConnections (J4.15)
B34_IO_L15_P: PLBank34 (IC2.C9), MezzanineConnections (J4.13)
B34_IO_L16_N: PLBank34 (IC2.A10), MezzanineConnections (J4.28)
B34_IO_L16_P: PLBank34 (IC2.B10), MezzanineConnections (J4.26)
B34_IO_L17_N: PLBank34 (IC2.A8), MezzanineConnections (J4.21)
B34_IO_L17_P: PLBank34 (IC2.A9), MezzanineConnections (J4.19)
B34_IO_L18_N: PLBank34 (IC2.A7), MezzanineConnections (J4.27)
B34_IO_L18_P: PLBank34 (IC2.B7), MezzanineConnections (J4.25)
B34_IO_L19_N: PLBank34 (IC2.C3), MezzanineConnections (J4.58)
B34_IO_L19_P: PLBank34 (IC2.C4), MezzanineConnections (J4.56)
B34_IO_L20_N: PLBank34 (IC2.B4), MezzanineConnections (J4.33)
B34_IO_L20_P: PLBank34 (IC2.B5), MezzanineConnections (J4.31)
B34_IO_L22_N: PLBank34 (IC2.A3), MezzanineConnections (J4.52)
B34_IO_L22_P: PLBank34 (IC2.A4), MezzanineConnections (J4.50)
B34_IO_L23_N: PLBank34 (IC2.B1), MezzanineConnections (J4.22)
B34_IO_L23_P: PLBank34 (IC2.C2), MezzanineConnections (J4.20)
B34_IO_L24_N: PLBank34 (IC2.A2), MezzanineConnections (J4.45)
B34_IO_L24_P: PLBank34 (IC2.B2), MezzanineConnections (J4.43)
B35_IO_L19_N: PLBank35 (IC2.C13), MezzanineConnections (J2.63)
B35_IO_L19_P: PLBank35 (IC2.D13), MezzanineConnections (J2.61)
B35_IO_L23_N: PLBank35 (IC2.B11), MezzanineConnections (J2.64)
B35_IO_L23_P: PLBank35 (IC2.C11), MezzanineConnections (J2.62)
BOOTMODE_0: SOCPSBanks (R52.1), MezzanineConnections (J2.39)
BOOTMODE_1: SOCPSBanks (R53.1), MezzanineConnections (J2.41)
DDR_A0: SOCDDR3Bank (IC2.K22 R65.2), DDR3Modules (IC5.N3 IC6.N3)
DDR_A1: SOCDDR3Bank (IC2.K20 R66.2), DDR3Modules (IC5.P7 IC6.P7)
DDR_A2: SOCDDR3Bank (IC2.N21 R67.2), DDR3Modules (IC5.P3 IC6.P3)
DDR_A3: SOCDDR3Bank (IC2.L22 R68.2), DDR3Modules (IC5.N2 IC6.N2)
DDR_A4: SOCDDR3Bank (IC2.M20 R69.2), DDR3Modules (IC5.P8 IC6.P8)
DDR_A5: SOCDDR3Bank (IC2.N22 R70.2), DDR3Modules (IC5.P2 IC6.P2)
DDR_A6: SOCDDR3Bank (IC2.L20 R71.2), DDR3Modules (IC5.R8 IC6.R8)
DDR_A7: SOCDDR3Bank (IC2.J21 R72.2), DDR3Modules (IC5.R2 IC6.R2)
DDR_A8: SOCDDR3Bank (IC2.T20 R73.2), DDR3Modules (IC5.T8 IC6.T8)
DDR_A9: SOCDDR3Bank (IC2.U20 R74.2), DDR3Modules (IC5.R3 IC6.R3)
DDR_A10: SOCDDR3Bank (IC2.M22 R75.2), DDR3Modules (IC5.L7 IC6.L7)
DDR_A11: SOCDDR3Bank (IC2.H21 R76.2), DDR3Modules (IC5.R7 IC6.R7)
DDR_A12: SOCDDR3Bank (IC2.P20 R77.2), DDR3Modules (IC5.N7 IC6.N7)
DDR_A13: SOCDDR3Bank (IC2.J20 R78.2), DDR3Modules (IC5.T3 IC6.T3)
DDR_A14: SOCDDR3Bank (IC2.R20 R79.2), DDR3Modules (IC5.T7 IC6.T7)
DDR_BA0: SOCDDR3Bank (IC2.U22 R80.2), DDR3Modules (IC5.M2 IC6.M2)
DDR_BA1: SOCDDR3Bank (IC2.T22 R81.2), DDR3Modules (IC5.N8 IC6.N8)
DDR_BA2: SOCDDR3Bank (IC2.R22 R82.2), DDR3Modules (IC5.M3 IC6.M3)
DDR_CAS#: SOCDDR3Bank (IC2.V23 R83.2), DDR3Modules (IC5.K3 IC6.K3)
DDR_CK_E: SOCDDR3Bank (IC2.U21 R86.2), DDR3Modules (IC5.K9 IC6.K9)
DDR_CK_N: SOCDDR3Bank (IC2.P21 R89.1), DDR3Modules (IC5.K7 IC6.K7)
DDR_CK_P: SOCDDR3Bank (IC2.R21 R89.2), DDR3Modules (IC5.J7 IC6.J7)
DDR_CS#: SOCDDR3Bank (IC2.Y21 R88.2), DDR3Modules (IC5.L2 IC6.L2)
DDR_D0: SOCDDR3Bank (IC2.J26), DDR3Modules (IC5.A3)
DDR_D1: SOCDDR3Bank (IC2.F25), DDR3Modules (IC5.C8)
DDR_D2: SOCDDR3Bank (IC2.J25), DDR3Modules (IC5.C2)
DDR_D3: SOCDDR3Bank (IC2.G26), DDR3Modules (IC5.B8)
DDR_D4: SOCDDR3Bank (IC2.H26), DDR3Modules (IC5.A7)
DDR_D5: SOCDDR3Bank (IC2.H23), DDR3Modules (IC5.D7)
DDR_D6: SOCDDR3Bank (IC2.J24), DDR3Modules (IC5.A2)
DDR_D7: SOCDDR3Bank (IC2.J23), DDR3Modules (IC5.C3)
DDR_D8: SOCDDR3Bank (IC2.K26), DDR3Modules (IC5.F7)
DDR_D9: SOCDDR3Bank (IC2.L23), DDR3Modules (IC5.H7)
DDR_D10: SOCDDR3Bank (IC2.M26), DDR3Modules (IC5.F2)
DDR_D11: SOCDDR3Bank (IC2.K23), DDR3Modules (IC5.H8)
DDR_D12: SOCDDR3Bank (IC2.M25), DDR3Modules (IC5.H3)
DDR_D13: SOCDDR3Bank (IC2.N24), DDR3Modules (IC5.G2)
DDR_D14: SOCDDR3Bank (IC2.M24), DDR3Modules (IC5.E3)
DDR_D15: SOCDDR3Bank (IC2.N23), DDR3Modules (IC5.F8)
DDR_D16: SOCDDR3Bank (IC2.R26), DDR3Modules (IC6.A7)
DDR_D17: SOCDDR3Bank (IC2.P24), DDR3Modules (IC6.B8)
DDR_D18: SOCDDR3Bank (IC2.N26), DDR3Modules (IC6.C8)
DDR_D19: SOCDDR3Bank (IC2.P23), DDR3Modules (IC6.D7)
DDR_D20: SOCDDR3Bank (IC2.T24), DDR3Modules (IC6.A2)
DDR_D21: SOCDDR3Bank (IC2.T25), DDR3Modules (IC6.A3)
DDR_D22: SOCDDR3Bank (IC2.T23), DDR3Modules (IC6.C2)
DDR_D23: SOCDDR3Bank (IC2.R23), DDR3Modules (IC6.C3)
DDR_D24: SOCDDR3Bank (IC2.V24), DDR3Modules (IC6.F7)
DDR_D25: SOCDDR3Bank (IC2.U26), DDR3Modules (IC6.H7)
DDR_D26: SOCDDR3Bank (IC2.U24), DDR3Modules (IC6.H8)
DDR_D27: SOCDDR3Bank (IC2.U25), DDR3Modules (IC6.F8)
DDR_D28: SOCDDR3Bank (IC2.W26), DDR3Modules (IC6.E3)
DDR_D29: SOCDDR3Bank (IC2.Y25), DDR3Modules (IC6.G2)
DDR_D30: SOCDDR3Bank (IC2.Y26), DDR3Modules (IC6.F2)
DDR_D31: SOCDDR3Bank (IC2.W23), DDR3Modules (IC6.H3)
DDR_DM0: SOCDDR3Bank (IC2.G24), DDR3Modules (IC5.D3)
DDR_DM1: SOCDDR3Bank (IC2.K25), DDR3Modules (IC5.E7)
DDR_DM2: SOCDDR3Bank (IC2.P26), DDR3Modules (IC6.D3)
DDR_DM3: SOCDDR3Bank (IC2.V26), DDR3Modules (IC6.E7)
DDR_DQS0_N: SOCDDR3Bank (IC2.G25), DDR3Modules (IC5.B7)
DDR_DQS0_P: SOCDDR3Bank (IC2.H24), DDR3Modules (IC5.C7)
DDR_DQS1_N: SOCDDR3Bank (IC2.L25), DDR3Modules (IC5.G3)
DDR_DQS1_P: SOCDDR3Bank (IC2.L24), DDR3Modules (IC5.F3)
DDR_DQS2_N: SOCDDR3Bank (IC2.R25), DDR3Modules (IC6.B7)
DDR_DQS2_P: SOCDDR3Bank (IC2.P25), DDR3Modules (IC6.C7)
DDR_DQS3_N: SOCDDR3Bank (IC2.W25), DDR3Modules (IC6.G3)
DDR_DQS3_P: SOCDDR3Bank (IC2.W24), DDR3Modules (IC6.F3)
DDR_ODT: SOCDDR3Bank (IC2.Y22 R87.2), DDR3Modules (IC5.K1 IC6.K1)
DDR_RAS#: SOCDDR3Bank (IC2.Y23 R84.2), DDR3Modules (IC5.J3 IC6.J3)
DDR_RESET#: SOCDDR3Bank (IC2.H22 R90.2), DDR3Modules (IC5.T2 IC6.T2)
DDR_WE#: SOCDDR3Bank (IC2.V22 R85.2), DDR3Modules (IC5.L3 IC6.L3)
ETH_CLK_125M_PL: PLBank12 (IC2.AD14), SOCEthernetPHY (R113.1)
ETH_LED0: SOCEthernetPHY (U1.32), MezzanineConnections (J2.47)
ETH_LED1: SOCEthernetPHY (U1.33), MezzanineConnections (J2.49)
ETH_LED2: SOCEthernetPHY (U1.34), MezzanineConnections (J2.51)
ETH_MDC: SOCPSBanks (IC2.A20), SOCEthernetPHY (U1.13)
ETH_MDI0_N: SOCEthernetPHY (U1.2), MezzanineConnections (J2.34)
ETH_MDI0_P: SOCEthernetPHY (U1.1), MezzanineConnections (J2.32)
ETH_MDI1_N: SOCEthernetPHY (U1.5), MezzanineConnections (J2.40)
ETH_MDI1_P: SOCEthernetPHY (U1.4), MezzanineConnections (J2.38)
ETH_MDI2_N: SOCEthernetPHY (U1.7), MezzanineConnections (J2.46)
ETH_MDI2_P: SOCEthernetPHY (U1.6), MezzanineConnections (J2.44)
ETH_MDI3_N: SOCEthernetPHY (U1.10), MezzanineConnections (J2.52)
ETH_MDI3_P: SOCEthernetPHY (U1.9), MezzanineConnections (J2.50)
ETH_MDIO: SOCPSBanks (IC2.A19), SOCEthernetPHY (R109.2 U1.14)
ETH_NINT: SOCPSBanks (IC2.F17), SOCEthernetPHY (R108.2 U1.31)
ETH_NRST_3V3: SOCPSBanks (IC4.4 R63.1), SOCEthernetPHY (U1.12)
ETH_PHY_TXD0: SOCPSBanks (R58.1), SOCEthernetPHY (U1.17)
ETH_PHY_TXD1: SOCPSBanks (R59.1), SOCEthernetPHY (U1.16)
ETH_PHY_TXD2: SOCPSBanks (R60.1), SOCEthernetPHY (U1.15)
ETH_PHY_TXD3: SOCPSBanks (R61.1), SOCEthernetPHY (U1.19)
ETH_PHY_TXDCLK: SOCPSBanks (R57.1), SOCEthernetPHY (U1.18)
ETH_PHY_TXDCTL: SOCPSBanks (R62.1), SOCEthernetPHY (U1.20)
ETH_RXD0: SOCPSBanks (IC2.F20), SOCEthernetPHY (R96.2 R100.2)
ETH_RXD1: SOCPSBanks (IC2.J19), SOCEthernetPHY (R97.2 R101.2 R107.1)
ETH_RXD2: SOCPSBanks (IC2.F19), SOCEthernetPHY (R98.2 R102.2)
ETH_RXD3: SOCPSBanks (IC2.H17), SOCEthernetPHY (R103.2 R105.1)
ETH_RXDCLK: SOCPSBanks (IC2.G22), SOCEthernetPHY (R95.2 R99.2)
ETH_RXDCTL: SOCPSBanks (IC2.F18), SOCEthernetPHY (R104.2 R106.1)
MGT_REFCLK_0_N: PLMGTBanks (IC2.R5), MezzanineConnections (J5.33)
MGT_REFCLK_0_P: PLMGTBanks (IC2.R6), MezzanineConnections (J5.31)
MGT_REFCLK_1_N: PLMGTBanks (IC2.U5), MezzanineConnections (J5.27)
MGT_REFCLK_1_P: PLMGTBanks (IC2.U6), MezzanineConnections (J5.25)
MGT_RX_0_N: PLMGTBanks (IC2.AB3), MezzanineConnections (J5.39)
MGT_RX_0_P: PLMGTBanks (IC2.AB4), MezzanineConnections (J5.37)
MGT_RX_1_N: PLMGTBanks (IC2.Y3), MezzanineConnections (J5.45)
MGT_RX_1_P: PLMGTBanks (IC2.Y4), MezzanineConnections (J5.43)
MGT_RX_2_N: PLMGTBanks (IC2.V3), MezzanineConnections (J5.51)
MGT_RX_2_P: PLMGTBanks (IC2.V4), MezzanineConnections (J5.49)
MGT_RX_3_N: PLMGTBanks (IC2.T3), MezzanineConnections (J5.57)
MGT_RX_3_P: PLMGTBanks (IC2.T4), MezzanineConnections (J5.55)
MGT_TX_0_N: PLMGTBanks (IC2.AA1), MezzanineConnections (J5.40)
MGT_TX_0_P: PLMGTBanks (IC2.AA2), MezzanineConnections (J5.38)
MGT_TX_1_N: PLMGTBanks (IC2.W1), MezzanineConnections (J5.46)
MGT_TX_1_P: PLMGTBanks (IC2.W2), MezzanineConnections (J5.44)
MGT_TX_2_N: PLMGTBanks (IC2.U1), MezzanineConnections (J5.52)
MGT_TX_2_P: PLMGTBanks (IC2.U2), MezzanineConnections (J5.50)
MGT_TX_3_N: PLMGTBanks (IC2.R1), MezzanineConnections (J5.58)
MGT_TX_3_P: PLMGTBanks (IC2.R2), MezzanineConnections (J5.56)
PROGRAM_B: SOCConfiguration (IC2.V9 R36.1), MezzanineConnections (J2.33)
PS_SRST: SOCPSBanks (IC2.A22 R42.1), MezzanineConnections (J2.43)
SYS_PG: SOCPowerSupplys (Q1.1 R26.1), SOCPSBanks (R44.1), MezzanineConnections (J2.35)
USB_CLK: SOCPSBanks (IC2.K16), SOCUSBHSPHY (U2.1)
USB_CPEN: SOCUSBHSPHY (U2.17), MezzanineConnections (J2.55)
USB_DATA0: SOCPSBanks (IC2.K17), SOCUSBHSPHY (U2.3)
USB_DATA1: SOCPSBanks (IC2.E22), SOCUSBHSPHY (U2.4)
USB_DATA2: SOCPSBanks (IC2.J16), SOCUSBHSPHY (U2.5)
USB_DATA3: SOCPSBanks (IC2.D19), SOCUSBHSPHY (U2.6)
USB_DATA4: SOCPSBanks (IC2.J18), SOCUSBHSPHY (U2.7)
USB_DATA5: SOCPSBanks (IC2.D20), SOCUSBHSPHY (U2.9)
USB_DATA6: SOCPSBanks (IC2.D21), SOCUSBHSPHY (U2.10)
USB_DATA7: SOCPSBanks (IC2.C21), SOCUSBHSPHY (U2.13)
USB_DIR: SOCPSBanks (IC2.E20), SOCUSBHSPHY (U2.31)
USB_HS_D_N: SOCUSBHSPHY (U2.19), MezzanineConnections (J2.58)
USB_HS_D_P: SOCUSBHSPHY (U2.18), MezzanineConnections (J2.56)
USB_NRST: SOCPSBanks (IC2.C22), SOCUSBHSPHY (R114.2 U2.27)
USB_NXT: SOCPSBanks (IC2.E21), SOCUSBHSPHY (U2.2)
USB_PHY_VBUS: SOCUSBHSPHY (U2.22), MezzanineConnections (J2.57)
USB_STP: SOCPSBanks (IC2.K19), SOCUSBHSPHY (U2.29)